# Altium schematic sheet DCU2.SchDoc
size B
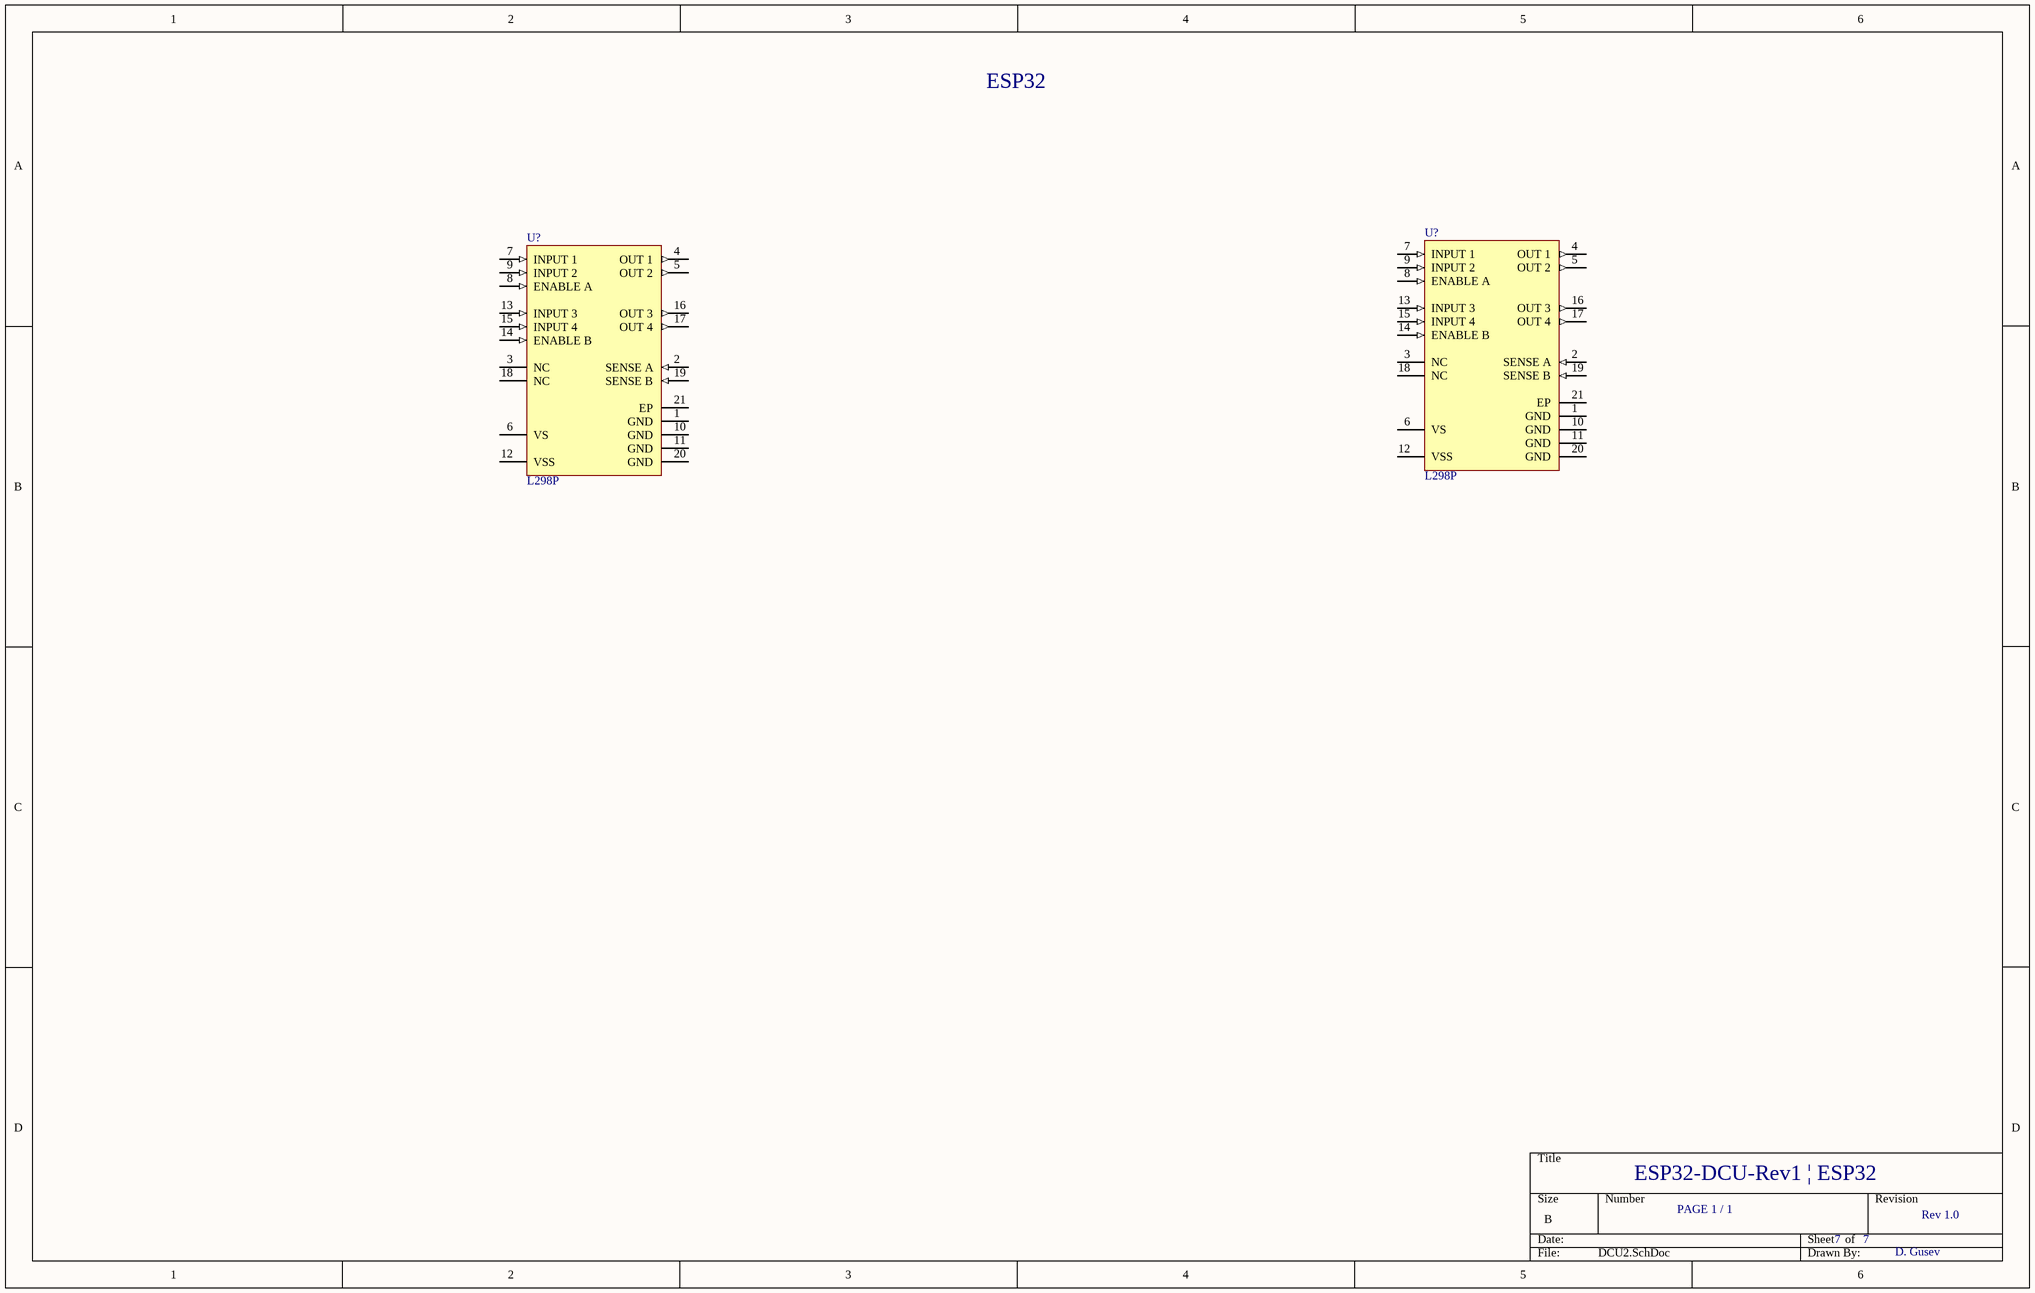
[diagram p0: DCU2.SchDoc]

## Parts
(Parts that share a designator on the sheet are numbered #1, #2 ... from top to bottom, then left to right.)
U?#1  L298P  [STM-PowerSO20_M]
U?#2  L298P  [STM-PowerSO20_M]

## Nets

Not connected (* = marked no-connect by the designer): U?#1 1(GND) 2(SENSE_A) 3(NC) 4(OUT_1) 5(OUT_2) 6(VS) 7(INPUT_1) 8(ENABLE_A) 9(INPUT_2) 10(GND) 11(GND) 12(VSS) 13(INPUT_3) 14(ENABLE_B) 15(INPUT_4) 16(OUT_3) 17(OUT_4) 18(NC) 19(SENSE_B) 20(GND) 21(EP); U?#2 1(GND) 2(SENSE_A) 3(NC) 4(OUT_1) 5(OUT_2) 6(VS) 7(INPUT_1) 8(ENABLE_A) 9(INPUT_2) 10(GND) 11(GND) 12(VSS) 13(INPUT_3) 14(ENABLE_B) 15(INPUT_4) 16(OUT_3) 17(OUT_4) 18(NC) 19(SENSE_B) 20(GND) 21(EP)

## Notes on the sheet
- ESP32
- ESP32-DCU-Rev1 | ESP32
- PAGE 1 / 1
- 7
- Rev 1.0
- D. Gusev

## Library data of the parts
U?#1 U?#2 = CMP-2100-03649-1: Dual Full-Bridge Driver, 4.5 to 7 V, -25 to 130 degC, 20-Pin SOIC, RoHS, Tube; Manufacturer: STMicroelectronics; Output Current: 2A; Collector Emitter Voltage (VCEO): 46V; Min Supply Voltage: 4.8V; Max Collector Current: 3A; Supply Voltage: 42V; Number of Channels: 2; Operating Supply Current: 13mA; Packaging: Rail/Tube; Package Reference: PowerSO20; Width: 11.1mm; Radiation Hardening: No; Height: 3.3mm; Lead Free: LeadFree; Datasheet Version: 36526.0; Datasheet URL: http://www.st.com/content/ccc/resource/technical/document/datasheet/82/cc/3f/39/0a/29/4d/f0/CD00000240.pdf/files/CD00000240.pdf/jcr:content/translations/en.CD00000240.pdf; RoHSCompliant: true; Max Supply Voltage: 46V; Output Current per Channel: 2A; Package Description: 20-Pin Small Outline Integrated Circuits, Body 15.9 x 11 mm, Pitch 1.27 mm; Case/Package: SOIC; Min Operating Temperature: -25degC; Number of Pins: 20; Length: 16mm; Max Output Current: 3A; Package Quantity: 31; Max Operating Temperature: 130degC; Mount: SurfaceMount; Manufacturer URL: http://www.st.com/